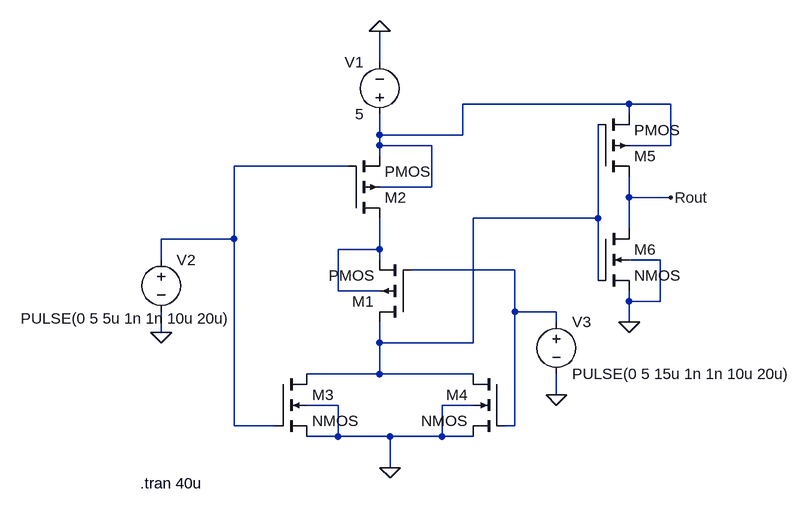
[diagram p0: schematic request-generating.asc]
request-generating.asc, the LTspice schematic file:
Version 4.1
SHEET 1 880 680
WIRE 192 -112 192 -160
WIRE 576 -48 320 -48
WIRE 640 -48 576 -48
WIRE 576 -32 576 -48
WIRE 192 0 192 -32
WIRE 320 0 320 -48
WIRE 320 0 192 0
WIRE 192 16 192 0
WIRE 272 16 192 16
WIRE 640 16 640 -48
WIRE 640 16 576 16
WIRE 192 32 192 16
WIRE 144 48 -32 48
WIRE 272 80 272 16
WIRE 272 80 192 80
WIRE 576 96 576 64
WIRE 640 96 576 96
WIRE 528 128 528 -16
WIRE 528 128 336 128
WIRE 576 144 576 96
WIRE -32 160 -32 48
WIRE -32 160 -144 160
WIRE 192 176 192 128
WIRE 192 176 128 176
WIRE -144 192 -144 160
WIRE 192 192 192 176
WIRE 624 192 576 192
WIRE 400 208 240 208
WIRE 528 224 528 128
WIRE 128 240 128 176
WIRE 192 240 128 240
WIRE 576 256 576 240
WIRE 624 256 624 192
WIRE 624 256 576 256
WIRE 400 272 400 208
WIRE 464 272 400 272
WIRE 464 288 464 272
WIRE 576 288 576 256
WIRE -144 304 -144 272
WIRE 192 320 192 288
WIRE 336 320 336 128
WIRE 336 320 192 320
WIRE 192 368 192 320
WIRE 192 368 80 368
WIRE 336 368 192 368
WIRE 464 400 464 368
WIRE 128 416 80 416
WIRE 336 416 288 416
WIRE -32 448 -32 160
WIRE 32 448 -32 448
WIRE 400 448 400 272
WIRE 400 448 384 448
WIRE 128 464 128 416
WIRE 128 464 80 464
WIRE 208 464 128 464
WIRE 288 464 288 416
WIRE 288 464 208 464
WIRE 336 464 288 464
WIRE 208 512 208 464
FLAG 192 -160 0
FLAG 208 512 0
FLAG -144 304 0
FLAG 464 400 0
FLAG 576 288 0
FLAG 640 96 Rout
SYMBOL pmos4 240 288 R180
SYMATTR InstName M1
SYMBOL pmos4 144 128 M180
SYMATTR InstName M2
SYMBOL nmos4 32 368 R0
SYMATTR InstName M3
SYMBOL nmos4 384 368 M0
SYMATTR InstName M4
SYMBOL voltage 192 -16 R180
WINDOW 0 24 96 Left 2
WINDOW 3 24 16 Left 2
WINDOW 123 0 0 Left 0
WINDOW 39 0 0 Left 0
SYMATTR InstName V1
SYMATTR Value 5
SYMBOL voltage -144 176 R0
WINDOW 123 0 0 Left 0
WINDOW 39 0 0 Left 0
WINDOW 3 -216 106 Left 2
SYMATTR InstName V2
SYMATTR Value PULSE(0 5 5u 1n 1n 10u 20u)
SYMBOL voltage 464 272 R0
WINDOW 123 0 0 Left 0
WINDOW 39 0 0 Left 0
SYMATTR InstName V3
SYMATTR Value PULSE(0 5 15u 1n 1n 10u 20u)
SYMBOL pmos4 528 64 M180
SYMATTR InstName M5
SYMBOL nmos4 528 144 R0
SYMATTR InstName M6
TEXT -176 536 Left 2 !.tran 40u

The netlist it stands for:
* request-generating.asc
M1 N003 N005 N004 N004 PMOS
M2 N004 N002 N001 N001 PMOS
M3 N003 N002 0 0 NMOS
M4 N003 N005 0 0 NMOS
V1 N001 0 5
V2 N002 0 PULSE(0 5 5u 1n 1n 10u 20u)
V3 N005 0 PULSE(0 5 15u 1n 1n 10u 20u)
M5 Rout N003 N001 N001 PMOS
M6 Rout N003 0 0 NMOS
.model NMOS NMOS
.model PMOS PMOS
.lib standard.mos
.tran 40u
.backanno
.end